# EAGLE design turing_base (EAGLE 5.10)
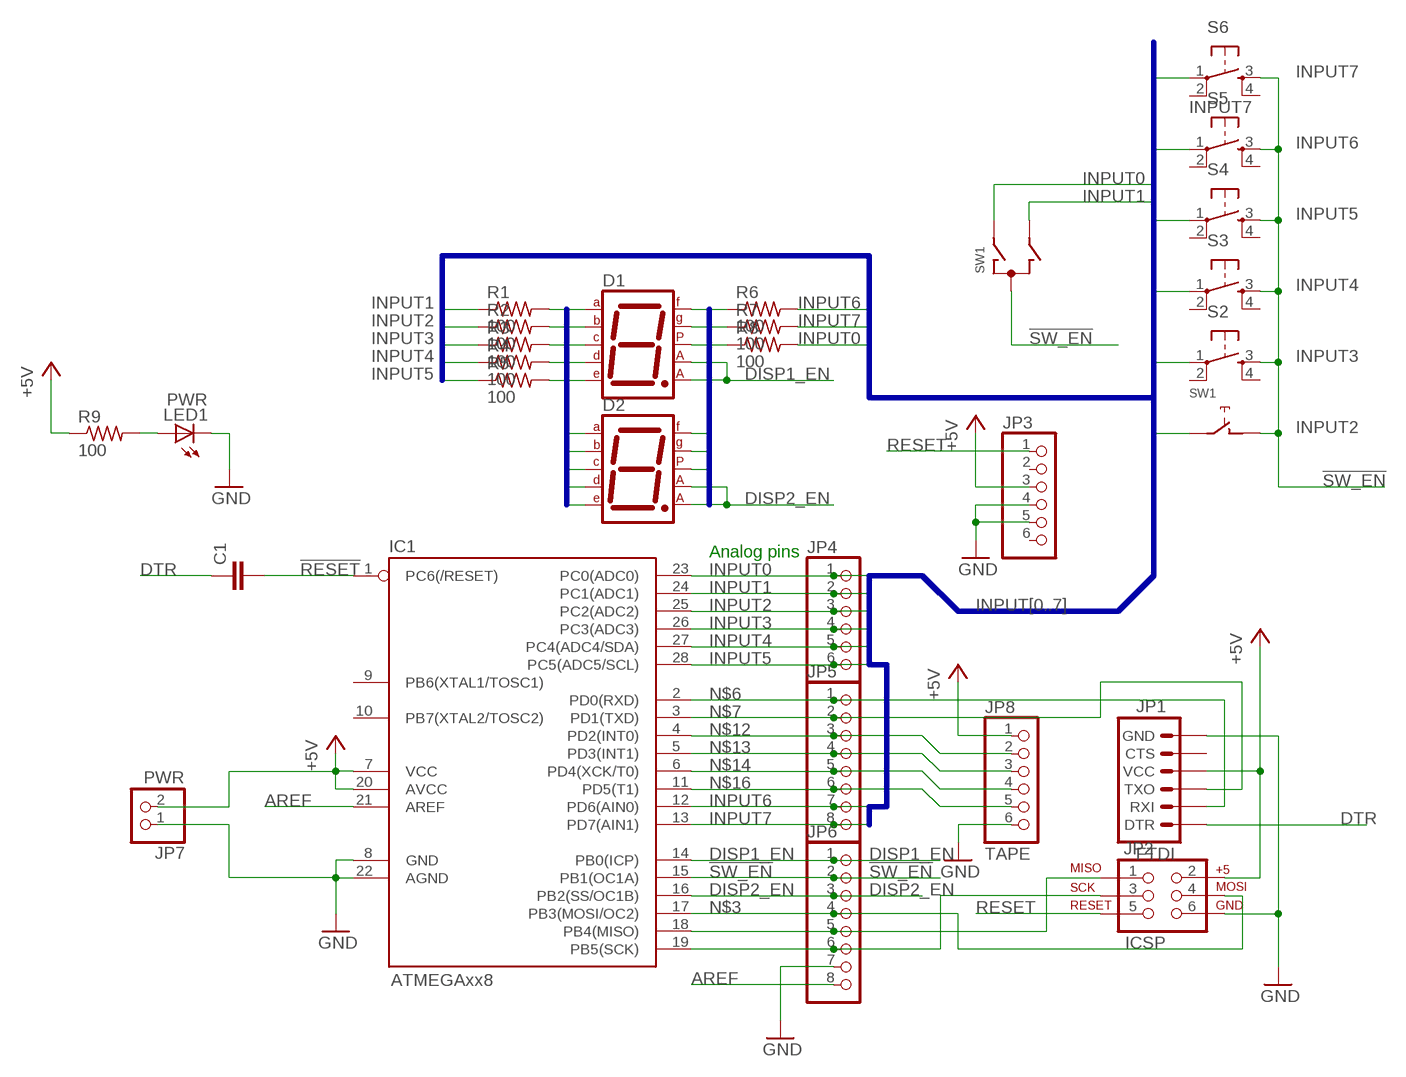
[diagram p0: schematic, sheet 1]

## Parts
C1  CAPPTH1  [CAP-PTH-5MM]
D1  7SEG-CA  [7SEG-13]
D2  7SEG-CA  [7SEG-13]
IC1  ATMEGAxx8  AVR-MEGA8-P  [DIL28-3]
JP1  FTDI  ARDUINO_SERIAL_PROGRAMPTH  [1X06]
JP2  ICSP  AVR_SPI_PRG_6PTH  [2X3]
JP3  PINHD-1X6  [1X06]
JP4  PINHD-1X6  [1X06]
JP5  PINHD-1X8  [1X08]
JP6  PINHD-1X8  [1X08]
JP7  PWR  PINHD-1X2  [1X02]
JP8  TAPE  PINHD-1X6  [1X06]
LED1  PWR  LED3MM  [LED3MM]
R1  100  R-US_0207/10  [0207/10]
R2  100  R-US_0207/10  [0207/10]
R3  100  R-US_0207/10  [0207/10]
R4  100  R-US_0207/10  [0207/10]
R5  100  R-US_0207/10  [0207/10]
R6  100  R-US_0207/10  [0207/10]
R7  100  R-US_0207/10  [0207/10]
R8  100  R-US_0207/10  [0207/10]
R9  100  R-US_0207/10  [0207/10]
S2  TAC_SWITCHPTH  [TACTILE-PTH]
S3  TAC_SWITCHPTH  [TACTILE-PTH]
S4  TAC_SWITCHPTH  [TACTILE-PTH]
S5  TAC_SWITCHPTH  [TACTILE-PTH]
S6  TAC_SWITCHPTH  [TACTILE-PTH]
SW1  EC12E_SW  [ALPS_EC12E_SW]

## Nets
!RESET: C1.2 IC1.1(PC6(/RESET))
!SW_EN: IC1.15(PB1(OC1A)) JP6.2 S2.3 S3.3 S4.3 S5.3 S6.3 SW1.C SW1.D
+5V [Supply]: IC1.7(VCC) IC1.20(AVCC) JP1.4(VCC) JP2.2 JP3.3 JP7.2 JP8.1 R9.1
AREF [Supply]: IC1.21(AREF) JP6.8
DISP1_EN [Supply]: D1.3(CA1) D1.8(CA2) IC1.14(PB0(ICP)) JP6.1
DISP2_EN [Supply]: D2.3(CA1) D2.8(CA2) IC1.16(PB2(SS/OC1B)) JP6.3
DTR: C1.1 JP1.1(DTR)
GND [Supply]: IC1.8(GND) IC1.22(AGND) JP1.6(GND) JP2.6 JP3.4 JP3.5 JP6.7 JP7.1 JP8.6 LED1.K(C)
INP0: D1.5(DP) D2.5(DP) R8.1
INP1: D1.7(A) D2.7(A) R1.2
INP2: D1.6(B) D2.6(B) R2.2
INP3: D1.4(C) D2.4(C) R3.2
INP4: D1.2(D) D2.2(D) R4.2
INP5: D1.1(E) D2.1(E) R5.2
INP6: D1.9(F) D2.9(F) R6.1
INP7: D1.10(G) D2.10(G) R7.1
INPUT0: IC1.23(PC0(ADC0)) JP4.1 R8.2 SW1.A
INPUT1: IC1.24(PC1(ADC1)) JP4.2 R1.1 SW1.B
INPUT2: IC1.25(PC2(ADC2)) JP4.3 R2.1 SW1.E
INPUT3: IC1.26(PC3(ADC3)) JP4.4 R3.1 S2.1
INPUT4: IC1.27(PC4(ADC4/SDA)) JP4.5 R4.1 S3.1
INPUT5: IC1.28(PC5(ADC5/SCL)) JP4.6 R5.1 S4.1
INPUT6: IC1.12(PD6(AIN0)) JP5.7 R6.2 S5.1
INPUT7: IC1.13(PD7(AIN1)) JP5.8 R7.2 S6.1
N$1: LED1.A R9.2
N$3: IC1.17(PB3(MOSI/OC2)) JP2.4 JP6.4
N$4: IC1.18(PB4(MISO)) JP2.1 JP6.5
N$5: IC1.19(PB5(SCK)) JP2.3 JP6.6
N$6: IC1.2(PD0(RXD)) JP1.2(RXI) JP5.1
N$7: IC1.3(PD1(TXD)) JP1.3(TXO) JP5.2
N$12: IC1.4(PD2(INT0)) JP5.3 JP8.2
N$13: IC1.5(PD3(INT1)) JP5.4 JP8.3
N$14: IC1.6(PD4(XCK/T0)) JP5.5 JP8.4
N$16: IC1.11(PD5(T1)) JP5.6 JP8.5
RESET: JP2.5 JP3.1
Unconnected: IC1.9(PB6(XTAL1/TOSC1)) IC1.10(PB7(XTAL2/TOSC2)) JP1.5(CTS) JP3.2 JP3.6 S2.2 S2.4 S3.2 S3.4 S4.2 S4.4 S5.2 S5.4 S6.2 S6.4 SW1.GND1(G) SW1.GND2(G)

## Buses
INPUT[0..7]
INP[1..5]
INP6,INP7,INP0

## Notes on the sheet
- Analog pins

## Library data of the parts
C1 = SparkFun:CAP: Capacitor Standard 0603 ceramic capacitor, and 0.1" leaded capacitor.
D1 D2 = special:7SEG-CA: 7-segment DISPLAY single anode, 13 mm
IC1 = SparkFun:AVR-MEGA8-P: MICROCONTROLLER 8 Kbytes FLASH 1 kbytes SRAM 512 bytes EEPROM USART 4-channel 10 bit ADC 2-channel 8 bit ADC
JP1 = SparkFun:ARDUINO_SERIAL_PROGRAM
JP2 = SparkFun:AVR_SPI_PRG_6: AVR ISP 6 Pin This is the reduced ISP connector for AVR programming. Common on Arduino. This footprint will take up less PCB space and can be used with a 10-pin to 6-pin adapter such as SKU: BOB-08508
JP3 JP4 JP8 = pinhead:PINHD-1X6: PIN HEADER
JP5 JP6 = pinhead:PINHD-1X8: PIN HEADER
JP7 = pinhead:PINHD-1X2: PIN HEADER
LED1 = led:LED: LED OSRAM: - CHIPLED LG R971, LG N971, LY N971, LG Q971, LY Q971, LO R971, LY R971 LH N974, LH R974 LS Q976, LO Q976, LY Q976 LO Q996 - Hyper CHIPLED LW Q18S LB Q993, LB Q99A, LB R99A - SideLED LS A670, LO A670, LY A670, LG A670, LP A670 LB A673, LV A673, LT A673, LW A673 LH A674 LY A675 LS A676, LA A676, LO A676, LY A676, LW A676 LS A679, LY A679, LG A679 - Hyper Micro SIDELED® LS Y876, LA Y876, LO Y876, LY Y876 LT Y87S - SmartLED LW L88C, LW L88S LB L89C, LB L89S, LG L890 LS L89K, LO L89K, LY L89K LS L896, LA L896, LO L896, LY L896 - TOPLED LS T670, LO T670, LY T670, LG T670, LP T670 LSG T670, LSP T670, LSY T670, LOP T670, LYG T670 LG T671, LOG T671, LSG T671 LB T673, LV T673, LT T673, LW T673 LH T674 LS T676, LA T676, LO T676, LY T676, LB T676, LH T676, LSB T676, LW T676 LB T67C, LV T67C, LT T67C, LS T67K, LO T67K, LY T67K, LW E67C LS E67B, LA E67B, LO E67B, LY E67B, LB E67C, LV E67C, LT E67C LW T67C LS T679, LY T679, LG T679 LS T770, LO T770, LY T770, LG T770, LP T770 LB T773, LV T773, LT T773, LW T773 LH T774 LS E675, LA E675, LY E675, LS T675 LS T776, LA T776, LO T776, LY T776, LB T776 LHGB T686 LT T68C, LB T68C - Hyper Mini TOPLED® LB M676 - Mini TOPLED Santana® LG M470 LS M47K, LO M47K, LY M47K Source: http://www.osram.convergy.de LUXEON: - LUMILED® LXK2-PW12-R00, LXK2-PW12-S00, LXK2-PW14-U00, LXK2-PW14-V00 LXK2-PM12-R00, LXK2-PM12-S00, LXK2-PM14-U00 LXK2-PE12-Q00, LXK2-PE12-R00, LXK2-PE12-S00, LXK2-PE14-T00, LXK2-PE14-U00 LXK2-PB12-K00, LXK2-PB12-L00, LXK2-PB12-M00, LXK2-PB14-N00, LXK2-PB14-P00, LXK2-PB14-Q00 LXK2-PR12-L00, LXK2-PR12-M00, LXK2-PR14-Q00, LXK2-PR14-R00 LXK2-PD12-Q00, LXK2-PD12-R00, LXK2-PD12-S00 LXK2-PH12-R00, LXK2-PH12-S00 LXK2-PL12-P00, LXK2-PL12-Q00, LXK2-PL12-R00 Source: www.luxeon.com KINGBRIGHT: KA-3528ASYC Source: www.kingbright.com
R1-R9 = resistor:R-US_: RESISTOR, American symbol
S2-S6 = SparkFun:TAC_SWITCH: Momentary Switch Button commonly used for reset or general input. Spark Fun Electronics SKU : COM-00097
SW1 = switch-alps:EC12E_SW: ALPS rotary Encoder EC12E series with switch

## Net classes
1 Supply: width 0.381 mm, clearance 0.254 mm

## Board
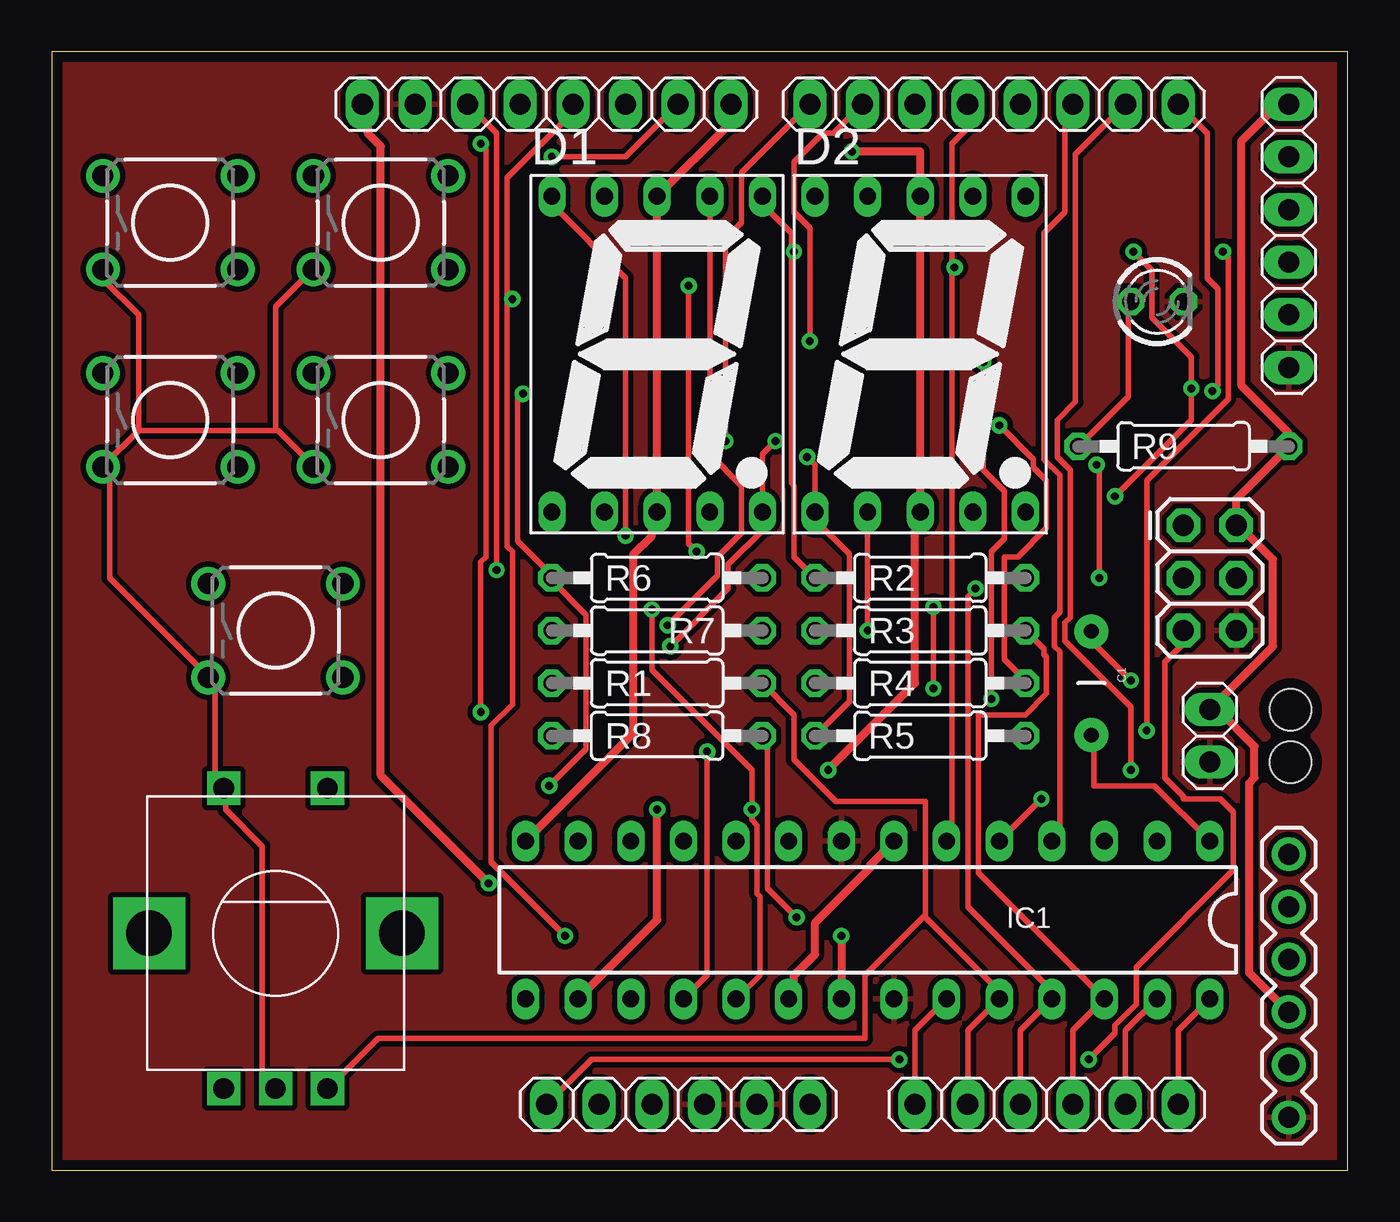
[diagram p1: board, top side]
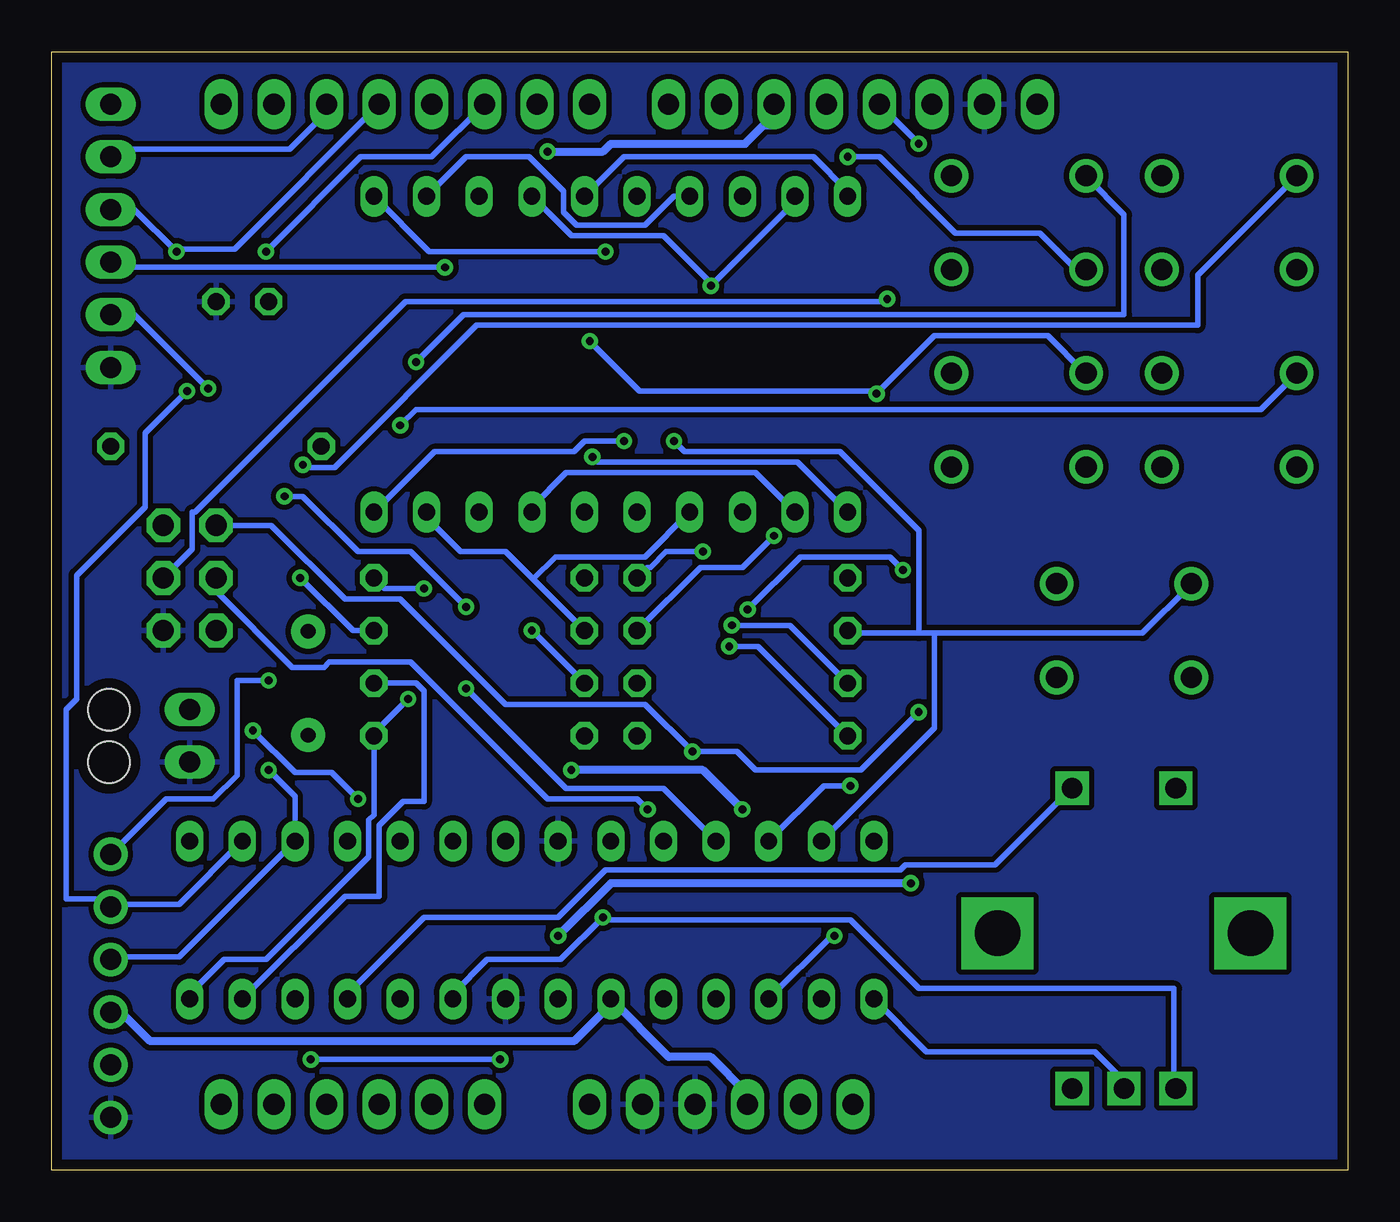
[diagram p2: board, bottom side, seen from below]

Size 62.54 x 53.97 mm. Coordinates in mm from the lower left corner, seen from the top.
Outline: 0,0 62.54,0 62.54,53.97 0,53.97 0,0
Copper layers (1*16): Top 0.035mm / dielectric 1.5mm / Bottom 0.035mm
Design rules "default *": minimum track width 10mil, minimum drill 15mil, track to track 8mil, track to pad 8mil, pad to pad 8mil, via to via 8mil, smd to smd 8mil, copper to edge 20mil, drill to drill 8mil, minimum pad ring 10mil, minimum via ring 8mil, stop-mask expansion 4mil, vias tented up to drill 25mil, thermal gap 10mil
Holes 2 mm at 59.77,22.23 59.77,19.68

### Footprints (pad centres in the part's own frame; a part is rotated, then mirrored left to right if it is on the bottom)
CAP-PTH-5MM = drill 0.7 pad 1.651 round: 1 -2.5,0; 2 2.5,0
7SEG-13 = drill 0.813 long: 1 -5.08,-7.62; 2 -2.54,-7.62; 3 0,-7.62; 4 2.54,-7.62; 5 5.08,-7.62; 6 5.08,7.62; 7 2.54,7.62; 8 0,7.62; 9 -2.54,7.62; 10 -5.08,7.62
DIL28-3 = drill 0.813 long: 1 -13.97,-3.81; 2 -11.43,-3.81; 3 -8.89,-3.81; 4 -6.35,-3.81; 5 -3.81,-3.81; 6 -1.27,-3.81; 7 1.27,-3.81; 8 3.81,-3.81; 9 6.35,-3.81; 10 8.89,-3.81; 11 11.43,-3.81; 12 13.97,-3.81; 13 16.51,-3.81; 14 19.05,-3.81; 15 19.05,3.81; 16 16.51,3.81; 17 13.97,3.81; 18 11.43,3.81; 19 8.89,3.81; 20 6.35,3.81; 21 3.81,3.81; 22 1.27,3.81; 23 -1.27,3.81; 24 -3.81,3.81; 25 -6.35,3.81; 26 -8.89,3.81; 27 -11.43,3.81; 28 -13.97,3.81
1X06 = drill 1.016 round: 1 0,0; 2 2.54,0; 3 5.08,0; 4 7.62,0; 5 10.16,0; 6 12.7,0
2X3 = drill 1.016 octagon: 1 0,0; 2 0,2.54; 3 2.54,0; 4 2.54,2.54; 5 5.08,0; 6 5.08,2.54
1X06' = drill 1.016 long: 1 -6.35,0; 2 -3.81,0; 3 -1.27,0; 4 1.27,0; 5 3.81,0; 6 6.35,0
1X08 = drill 1.016 long: 1 -8.89,0; 2 -6.35,0; 3 -3.81,0; 4 -1.27,0; 5 1.27,0; 6 3.81,0; 7 6.35,0; 8 8.89,0
1X02 = drill 1.016 long: 1 -1.27,0; 2 1.27,0
LED3MM = drill 0.813 octagon: A -1.27,0; K 1.27,0
0207/10 = drill 0.813 octagon: 1 -5.08,0; 2 5.08,0
TACTILE-PTH = drill 1.016 round: 1 -3.251,2.261; 2 3.251,2.261; 3 -3.251,-2.261; 4 3.251,-2.261
ALPS_EC12E_SW = drill 1 square: A -2.5,-7.5; B 2.5,-7.5; C 0,-7.5; D -2.5,7; E 2.5,7 | drill 2.2 square: GND1 -6.1,0; GND2 6.1,0

### Placement (x,y rotation side)
C1  50.16,23.5 270 top
D1  29.21,39.37 0 top
D2  41.91,39.37 0 top
IC1  41.91,12.06 180 top
JP1  59.69,15.24 270 top
JP2  54.61,31.11 270 top
JP3  [1X06']  30.23,3.17 0 top
JP4  [1X06']  48.01,3.17 0 top
JP5  45.47,51.44 180 top
JP6  23.88,51.44 180 top
JP7  55.88,20.95 90 top
JP8  TAPE  [1X06']  59.69,45.09 270 top
LED1  53.34,41.91 0 top
R1  29.21,23.5 180 top
R2  41.91,28.57 180 top
R3  41.91,26.04 180 top
R4  41.91,23.5 180 top
R5  41.91,20.95 180 top
R6  29.21,28.57 180 top
R7  29.21,26.04 180 top
R8  29.21,20.95 0 top
R9  54.61,34.92 180 top
S2  5.71,45.72 0 top
S3  5.71,36.2 0 top
S4  15.88,45.72 0 top
S5  15.88,36.2 0 top
S6  10.79,26.04 0 top
SW1  10.79,11.43 0 top

### Tracks (layer width: path | path; a pad name or v marks a point on that pad's centre or on a via)
!RESET
  Top 0.254: IC1.1 53.21,18.54 50.29,18.54 50.29,20.83 50.16,20.95 C1.2
!SW_EN  (via drill 0.38)
  Top 0.254: 4.19,35.69 2.54,34.04 S3.3 2.79,34.16 2.79,28.57 7.49,23.88 S6.3 7.49,23.75 7.49,23.37 7.87,22.99 7.87,18.92 8.26,18.54 SW1.D 8.38,18.41 8.38,17.4 10.16,15.62 10.16,4.57 SW1.C | 4.19,35.69 4.19,41.27 2.54,42.93 2.54,43.43 S2.3 | 4.19,35.69 10.79,35.69 | 10.79,35.69 10.92,35.69 12.57,34.04 S5.3 | 10.79,35.69 10.79,41.66 12.57,43.43 S4.3 | JP6.2 27.69,48.9 v24.13,48.9
  Bottom 0.254: IC1.15 20.32,5.71 12.19,5.71 10.79,4.32 SW1.C | v24.13,48.9 22.61,48.9 18.92,45.21 14.86,45.21 13.21,43.56 12.7,43.56 S4.3
+5V
  Top 0.381: IC1.7 39.5,14.73 39.5,14.61 36.83,11.94 36.83,10.41 35.81,9.4 35.81,9.14 35.56,8.89 IC1.20 | JP1.4 57.79,9.53 57.79,18.67 58.04,18.92 58.04,20.45 56.26,22.23 56.26,22.35 JP7.2 58.93,25.27 58.93,29.46 57.28,31.11 JP2.2 57.15,32.38 R9.1 59.69,35.56 57.4,37.85 57.4,49.66 58.67,50.93 58.67,51.44 JP8.1
  Bottom 0.381: JP3.3 28.96,3.68 30.73,5.46 32.77,5.46 IC1.20 35.56,8 37.34,6.22 57.79,6.22 59.18,7.62 JP1.4
AREF  (via drill 0.38)
  Top 0.381: v38.1,11.3 IC1.21 | v21.08,13.84 15.88,19.05 15.88,49.4 15.24,50.04 15.24,50.29 14.99,50.55 JP6.8
  Bottom 0.381: v38.1,11.3 35.56,13.84 v21.08,13.84
DISP1_EN
  Top 0.381: JP6.1 32.77,50.55 D1.8 D1.3 29.21,31.11 28.96,30.86 28.96,30.61 28.07,29.72 28.07,21.08 IC1.14
DISP2_EN  (via drill 0.38)
  Top 0.381: IC1.16 29.21,12.06 v29.21,17.4 | v37.47,19.3 41.66,23.5 41.66,30.86 41.91,31.11 D2.3 D2.8 41.91,49.15 v38.61,49.15
  Bottom 0.381: v29.21,17.4 31.11,19.3 v37.47,19.3 | JP6.3 27.69,50.42 28.19,50.42 29.08,49.53 35.56,49.53 35.94,49.15 v38.61,49.15
DTR  (via drill 0.38)
  Top 0.254: v52.07,23.62 50.16,25.53 C1.1
  Bottom 0.254: JP1.1 57.02,17.91 54.74,17.91 53.59,19.05 53.59,23.62 v52.07,23.62
GND
  pour Top: -0.64,54.61 -0.64,-0.64 62.87,-0.64 62.87,54.61
  pour Bottom: -0.64,54.61 -0.64,-0.64 64.13,-0.64 64.13,54.61
INP0  (via drill 0.38)
  Top 0.254: v29.84,25.27 32.64,28.07 32.64,29.21 34.42,30.99 34.42,31.62 D1.5 34.29,34.54 v34.93,35.18
  Bottom 0.254: R8.1 28.45,25.27 v29.84,25.27 | D2.5 44.07,34.67 37.34,34.67 36.83,35.18 v34.93,35.18
INP1  (via drill 0.38)
  Top 0.254: v29.72,26.29 32.13,28.7 32.13,29.59 33.27,30.73 33.27,33.02 31.75,34.54 D1.7
  Bottom 0.254: R1.2 26.92,26.29 v29.72,26.29 | D2.7 42.55,48.9 39.5,48.9 37.85,47.24 37.85,46.23 37.21,45.59 33.91,45.59 32.51,46.99 D1.7
INP2  (via drill 0.38)
  Top 0.254: R2.2 35.81,29.59 35.81,33.02 35.69,33.15 35.69,44.32 | 35.69,44.32 35.69,45.21 34.29,46.61 D1.6 | 35.69,44.32 v35.81,44.32
  Bottom 0.254: D2.6 44.32,44.32 v35.81,44.32
INP3
  Bottom 0.254: 39.31,28.51 40.64,29.84 42.8,29.84 44.45,31.5 D2.4 | 39.31,28.51 R3.2 | D1.4 33.91,29.59 38.23,29.59 39.31,28.51
INP4  (via drill 0.38)
  Top 0.254: D2.2 v39.37,26.04
  Bottom 0.254: v39.37,26.04 R4.2 | D1.2 28.57,33.66 37.72,33.66 39.37,32 D2.2
INP5  (via drill 0.38)
  Top 0.254: v36.45,34.42 36.83,34.04 D2.1 36.83,31.37 38.48,29.72 38.48,22.61 R5.2
  Bottom 0.254: D1.1 26.54,34.16 36.2,34.16 v36.45,34.42
INP6  (via drill 0.38)
  Top 0.254: v31.11,29.84 30.73,30.23 v30.73,42.67
  Bottom 0.254: R6.1 33.78,29.08 33.66,29.08 32.89,29.84 v31.11,29.84 | D1.9 26.67,46.74 v30.73,42.67 30.73,42.8 33.02,45.09 37.47,45.09 D2.9
INP7  (via drill 0.38)
  Top 0.254: v27.69,30.61 27.69,43.05 24.13,46.61 D1.10
  Bottom 0.254: R7.1 31.24,29.08 29.21,29.08 v27.69,30.61 | D2.10 34.93,48.9 25.78,48.9 24.13,47.24 D1.10
INPUT0  (via drill 0.38)
  Top 0.254: IC1.23 41.66,6.73 JP4.1 | R8.2 34.54,20.7 34.54,13.59 v35.94,12.19
  Bottom 0.254: IC1.23 43.18,8.51 41.53,10.16 37.97,10.16 v35.94,12.19 35.94,12.06 24,12.06 20.7,8.76 8.38,8.76 8.38,3.94 SW1.A
INPUT1
  Top 0.254: JP4.2 44.2,6.73 IC1.24 45.59,8.26 45.59,8.76 42.16,12.19 42.16,12.32 | R1.1 35.81,21.97 35.81,19.81 37.85,17.78 42.16,17.78 42.16,12.32 | 42.16,12.32 39.24,9.4 39.24,6.35 15.75,6.35 13.34,3.94 SW1.B
INPUT2  (via drill 0.38)
  Top 0.254: JP4.3 46.74,6.73 IC1.25 48.13,8.26 48.13,8.76 44.2,12.7 44.2,27.69 v44.58,28.07
  Bottom 0.254: R2.1 46.48,28.07 v44.58,28.07 | IC1.25 48.26,8.51 44.58,12.19 38.1,12.19 35.81,14.48 21.59,14.48 21.34,14.73 17.02,14.73 13.34,18.41 SW1.E
INPUT3  (via drill 0.38)
  Top 0.254: JP4.4 49.28,6.73 IC1.26 50.67,8.26 50.67,8.38 44.7,14.35 44.7,21.97 46.99,21.97 48.01,22.99 48.01,24.77 47.88,24.89 47.88,25.15 R3.1 | v50.42,34.04 50.55,33.91 v50.55,28.57
  Bottom 0.254: v50.42,34.04 50.29,33.91 48.9,33.91 42.04,40.77 7.24,40.77 7.24,43.18 2.54,47.88 S2.1 | v50.55,28.57 48.01,26.04 R3.1
INPUT4  (via drill 0.38)
  Top 0.254: IC1.27 51.82,6.73 JP4.5 | v45.72,35.94 47.37,34.29 47.37,33.91 48.01,33.27 48.01,30.99 46.61,29.59 45.97,29.59 45.97,24.64 46.99,23.62 R4.1
  Bottom 0.254: R4.1 44.96,23.5 44.58,23.11 44.58,17.78 45.59,17.78 46.74,16.64 46.74,13.21 48.39,13.21 IC1.27 | v45.72,35.94 44.96,36.7 4.19,36.7 2.54,38.35 S3.1
INPUT5  (via drill 0.38)
  Top 0.254: IC1.28 54.36,6.73 JP4.6 | v44.96,38.99 44.96,33.78 45.97,32.77 45.97,30.48 45.34,29.84 v45.34,22.73
  Bottom 0.254: IC1.28 55.88,8.51 54.23,10.16 52.2,10.16 47.24,15.11 47.24,16.89 46.99,17.14 R5.1 46.99,21.08 v45.34,22.73 | v44.96,38.99 42.67,41.27 10.79,41.27 10.79,46.1 12.57,47.88 S4.1
INPUT6  (via drill 0.38)
  Top 0.254: v24,18.54 25.78,20.32 25.78,26.8 24.13,28.45 R6.2 24.13,28.7 22.48,30.35 22.48,37.21 v22.73,37.47 | JP5.7 37.72,50.04 37.21,50.04 35.81,48.64 35.81,46.23 36.58,45.47 v36.58,40.01
  Bottom 0.254: IC1.12 25.27,18.54 v24,18.54 | S5.1 12.7,38.48 14.48,40.26 19.94,40.26 v22.73,37.47 22.73,37.59 34.16,37.59 v36.58,40.01
INPUT7  (via drill 0.38)
  Top 0.254: JP5.8 33.27,48.13 33.27,45.72 32.51,44.96 v32.51,35.18
  Bottom 0.254: IC1.13 19.94,21.34 19.94,25.91 | 20.7,25.91 24,25.91 R7.2 | 19.94,25.91 20.7,25.91 | 19.94,25.91 9.91,25.91 7.62,28.19 S6.1 | v32.51,35.18 32,34.67 24.51,34.67 20.7,30.86 20.7,25.91
N$1
  Top 0.254: R9.2 51.94,37.34 51.94,41.78 LED1.A
N$3  (via drill 0.38)
  Top 0.254: v24.76,11.3 21.21,14.86 21.21,21.46 22.22,22.48 22.22,29.84 21.97,30.1 21.97,42.04 | 21.97,42.04 21.97,47.88 25.15,51.05 JP6.4 | 21.97,42.04 v22.22,42.04
  Bottom 0.254: IC1.17 24.89,11.3 v24.76,11.3 | JP2.4 55.75,29.97 55.75,31.75 55.63,31.75 45.47,41.91 22.35,41.91 v22.22,42.04
N$4  (via drill 0.38)
  Top 0.254: IC1.18 31.62,9.4 v31.62,20.19 | v20.7,49.53 20.95,49.28 20.95,29.59 20.7,29.34 v20.7,22.1
  Bottom 0.254: JP2.1 51.94,31.11 48.39,27.56 45.72,27.56 40.64,22.48 33.91,22.48 v31.62,20.19 29.46,20.19 28.57,19.3 23.49,19.3 v20.7,22.1 | v20.7,49.53 JP6.5
N$5  (via drill 0.38)
  Top 0.254: IC1.19 34.16,9.4 34.16,13.21 34.04,13.34 34.04,16.64 33.78,16.89 v33.78,17.4 33.78,19.3 28.96,24.13 v28.96,27.05 | JP6.6 21.46,50.04 v21.46,28.96
  Bottom 0.254: v33.78,17.4 34.29,17.91 38.61,17.91 45.21,24.51 49.15,24.51 49.4,24.26 50.93,24.26 54.61,27.94 JP2.3 | v21.46,28.96 22.1,29.59 26.42,29.59 v28.96,27.05
N$6  (via drill 0.38)
  Top 0.254: JP5.1 55.75,50.04 55.75,43.05 56.26,42.55 56.26,37.85 v56.01,37.59
  Bottom 0.254: IC1.2 56.39,12.83 59.56,12.83 JP1.2 59.69,12.83 60.2,12.83 60.45,13.08 61.85,13.08 61.85,22.23 61.34,22.73 61.34,28.7 58.04,32 58.04,35.56 v56.01,37.59
N$7  (via drill 0.38)
  Top 0.254: JP5.2 49.4,49.02 49.4,37.08 48.51,36.2 48.51,34.42 49.15,33.78 49.15,26.67 48.9,26.42 48.9,25.53 52.07,22.35 v52.07,19.3
  Bottom 0.254: JP1.3 59.56,10.29 56.39,10.29 IC1.3 50.8,18.03 v52.07,19.3
N$12
  Top 0.254: IC1.4 48.64,16.26 48.64,25.02 48.39,25.27 48.39,26.67 48.64,26.92 48.64,33.53 47.88,34.29 47.88,45.21 48.9,46.23 48.9,50.29 49.28,50.67 JP5.3
  Bottom 0.254: JP8.2 59.31,49.28 51.05,49.28 49.28,51.05 JP5.3
N$13  (via drill 0.38)
  Top 0.254: IC1.5 v47.75,17.91 | v52.83,21.21 52.83,33.27 56.77,37.21 56.77,44.07 v56.52,44.32
  Bottom 0.254: v47.75,17.91 49.02,19.18 50.8,19.18 v52.83,21.21 | JP8.3 58.55,46.35 v56.52,44.32 56.52,44.45 53.72,44.45 JP5.4
N$14  (via drill 0.38)
  Top 0.254: IC1.6 43.43,16.13 43.43,43.56 | 43.43,43.56 43.43,49.53 44.2,50.29 JP5.5 | 43.43,43.56 v43.56,43.56
  Bottom 0.254: JP8.4 59.44,43.56 v43.56,43.56
N$16  (via drill 0.38)
  Top 0.254: v42.55,23.24 v42.55,27.18 | v51.31,32.51 54.99,36.2 v54.99,37.72 54.99,39.24 53.09,41.15 53.09,43.43 v52.2,44.32
  Bottom 0.254: IC1.11 33.02,18.41 37.72,18.41 v42.55,23.24 | v42.55,27.18 45.21,29.84 47.75,29.84 50.42,32.51 v51.31,32.51 | v54.99,37.72 58.55,41.27 JP8.5 | JP5.6 44.2,48.9 47.62,48.9 v52.2,44.32
RESET  (via drill 0.38)
  Top 0.254: JP3.1 26.04,5.33 v40.89,5.33 | v50.04,5.33 51.31,6.6 51.31,6.99 52.32,8 52.32,9.78 57.02,14.48 57.02,17.27 56.39,17.91 54.61,17.91 54.61,18.03 53.72,18.92 53.72,24.51 54.61,25.4 JP2.5
  Bottom 0.254: v40.89,5.33 v50.04,5.33

### Text on the board
TOP_INFO: State # | 5V | GND | Turing Machine
BTM_INFO: cc by-sa 3.0 | zbanks 9-10 | olopede.com/turing